# Altium schematic sheet AMS Board schematic.SchDoc
size A4; SheetNumber: 2; SheetTotal: 3
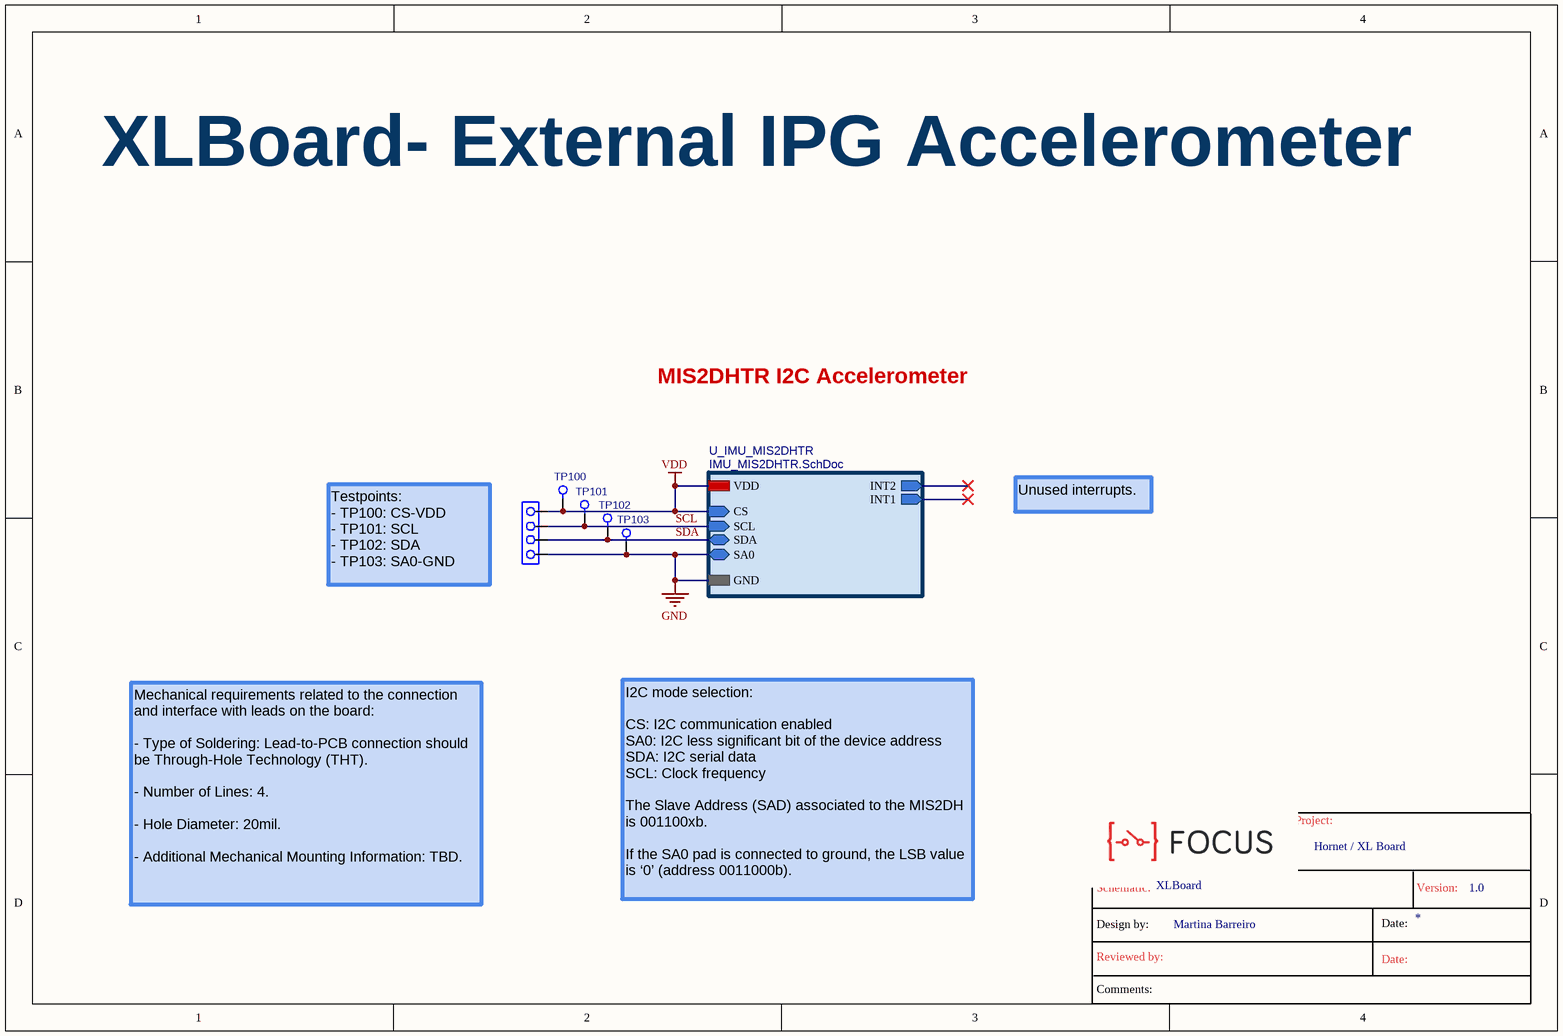
[diagram p0: AMS Board schematic.SchDoc]

## Parts
J100  THPAD_20m  [FEEDHOLE_20mil]  (value not drawn)  (no BOM)
J101  THPAD_20m  [FEEDHOLE_20mil]  (value not drawn)  (no BOM)
J102  THPAD_20m  [FEEDHOLE_20mil]  (value not drawn)  (no BOM)
J103  THPAD_20m  [FEEDHOLE_20mil]  (value not drawn)  (no BOM)
TP100  Test Point  [testpad_0.9mm]  (value not drawn)  (no BOM)
TP101  Test Point  [testpad_0.9mm]  (value not drawn)  (no BOM)
TP102  Test Point  [testpad_0.9mm]  (value not drawn)  (no BOM)
TP103  Test Point  [testpad_0.9mm]  (value not drawn)  (no BOM)

## Sub-sheets
U_IMU_MIS2DHTR = IMU_MIS2DHTR.SchDoc: VDD, GND, INT2 (out), INT1 (out), SA0 (bidir), CS (in), SDA (bidir), SCL (in)

## Nets
GND: J103.1 TP103.1 ; sheet U_IMU_MIS2DHTR/GND, sheet U_IMU_MIS2DHTR/SA0
VDD: J100.1 TP100.1 ; sheet U_IMU_MIS2DHTR/VDD, sheet U_IMU_MIS2DHTR/CS
SCL: J101.1 TP101.1 ; sheet U_IMU_MIS2DHTR/SCL
SDA: J102.1 TP102.1 ; sheet U_IMU_MIS2DHTR/SDA

## Notes on the sheet
- XLBoard- External IPG Accelerometer
- MIS2DHTR I2C Accelerometer
- Unused interrupts.
- Testpoints:
  - TP100: CS-VDD
  - TP101: SCL
  - TP102: SDA
  - TP103: SA0-GND
- Hornet / XL Board
- Mechanical requirements related to the connection and interface with leads on the board:
  - Type of Soldering: Lead-to-PCB connection should be Through-Hole Technology (THT).
  - Number of Lines: 4.
  - Hole Diameter: 20mil.
  - Additional Mechanical Mounting Information: TBD.
- I2C mode selection:
  CS: I2C communication enabled
  SA0: I2C less significant bit of the device address
  SDA: I2C serial data
  SCL: Clock frequency
  The Slave Address (SAD) associated to the MIS2DH is 001100xb.
  If the SA0 pad is connected to ground, the LSB value is ‘0’ (address 0011000b).
- XLBoard
- 1.0
- Martina Barreiro
- Project:
- Schematic:
- Version:
- Design by:
- Reviewed by:
- Date:
- Comments:

## Library data of the parts
J100-J103 = HOLE_20m: FT pad, Thru-hole, 20 mil hole; PCB Footprint: TBD; Value: FT pad; Category: FT pad; Length (mm): TBD; Manufacturer: N/A; Manufacturer PN: N/A; Medical Grade MFR: N/A; Medical Grade MFR PN: N/A; Rating: N/A; Thickness (mm): N/A; Width (mm): TBD; Package Description: FT pad; Status: *; Review: *
TP100-TP103 = Test Point: Test pad, 0.90mm circular pad; PCB Footprint: testpad_0p90mm; Length (mm): 0.90; Manufacturer: N/A; Manufacturer PN: N/A; Medical Grade MFR: N/A; Medical Grade MFR PN: N/A; Rating: N/A; Thickness (mm): N/A; Value: Test point; Width (mm): 0.90; Category: Test point; Status: *; Review: *